# Altium schematic sheet WS2812 Xmas Lights.SchDoc
size A4
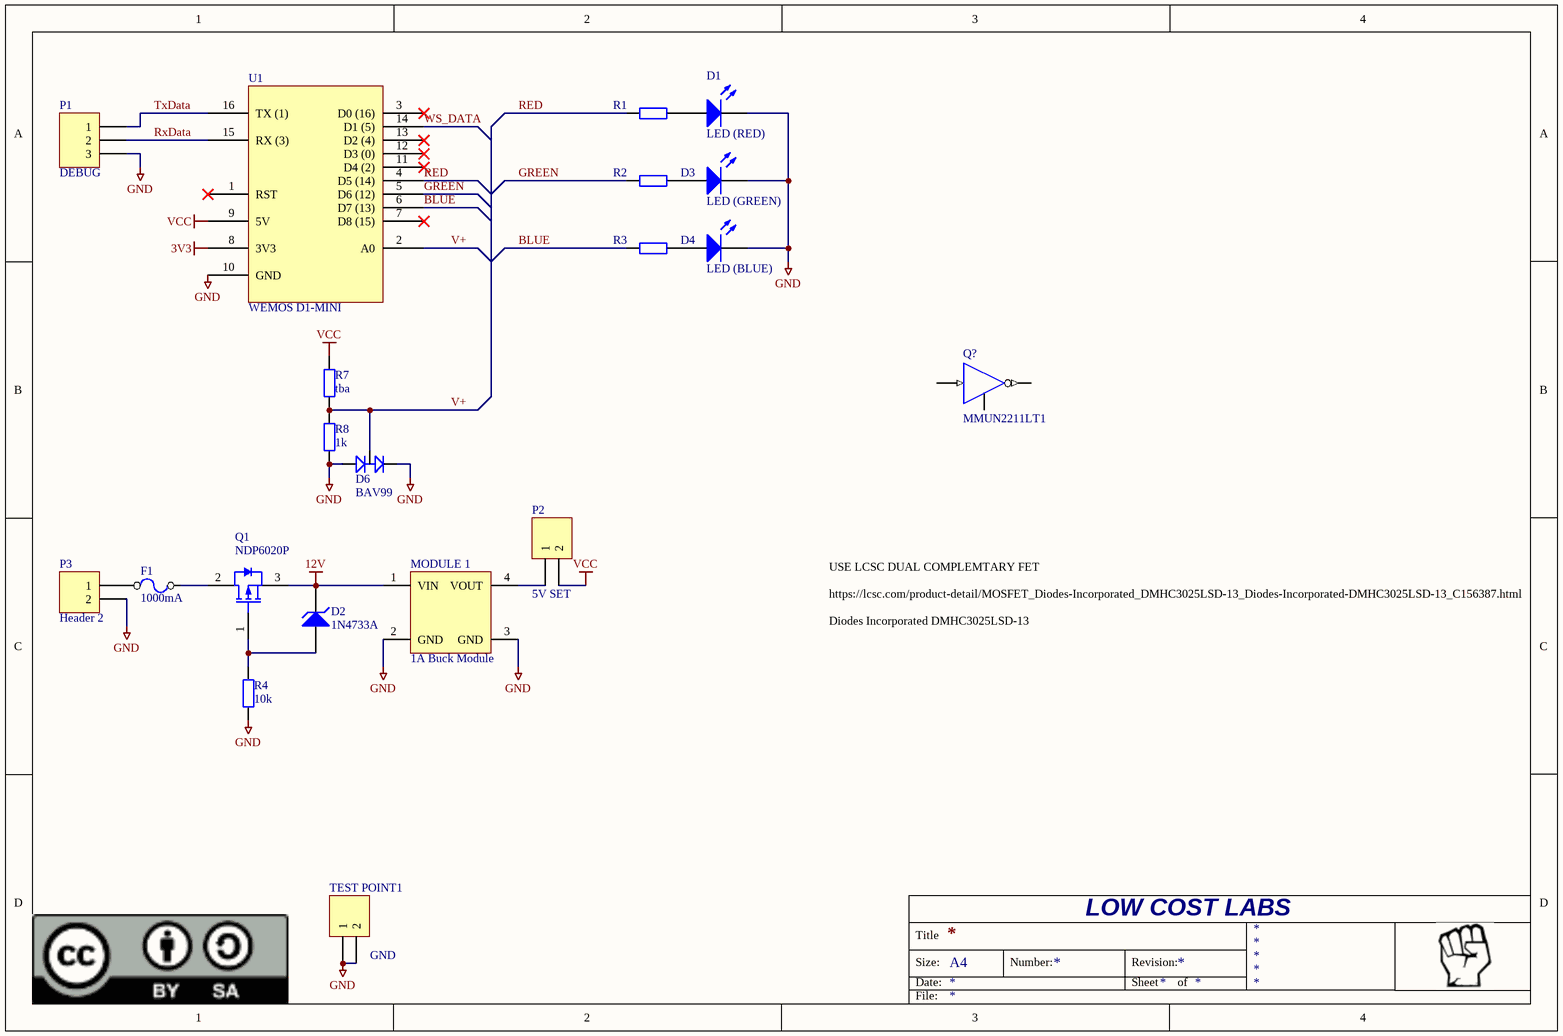
[diagram p0: WS2812 Xmas Lights.SchDoc]

## Parts
D1  LED (RED)  [LED(3D) 3MM VERTICAL (RED)]
D2  1N4733A  [DO-41]
D3  LED (GREEN)  [LED(3D) 3MM VERTICAL (GREEN)]
D4  LED (BLUE)  [LED(3D) 3MM VERTICAL (GREEN)]
D6  BAV99  [SOT23-3L]
F1  1000mA  [POLYSWITHC 1210]
MODULE_1  1A Buck Module  [3A BUCK]
P1  DEBUG  [Pin Header 1x3 TH Pitch 2.54mm]
P2  5V SET  [Pin Header 1x2 TH Pitch 2.54mm]
P3  Header 2  [2 FLYING WIRES]
Q1  NDP6020P  [TO-220AB - RIGHT ANGLE]
Q?  MMUN2211LT1  [SOT23-3L]
R1  (no value)  [RESISTOR 0805]
R2  (no value)  [RESISTOR 0805]
R3  (no value)  [RESISTOR 0805]
R4  10k  [RESISTOR 0805]
R7  tba  [RESISTOR 0805]
R8  1k  [RESISTOR 0805]
TEST_POINT1  GND  [Pin Header 1x2 TH Pitch 2.54mm]
U1  WEMOS D1-MINI  [WEMOS PRO MINI]

## Nets
3V3: U1.8(3V3)
12V: D2.1(K) MODULE_1.1(VIN) Q1.3(S)
GND: D1.2(K) D3.2(K) D4.2(K) D6.1(A1) D6.2(C2) MODULE_1.2(GND) MODULE_1.3(GND) P1.3 P3.2 R4.1 R8.1 TEST_POINT1.1 TEST_POINT1.2 U1.10(GND)
VCC: P2.2 R7.2 U1.9(5V)
BLUE: R3.2 U1.6(D7_(13))
GREEN: R2.1 U1.5(D6_(12))
RED: R1.1 U1.4(D5_(14))
RxData: P1.2 U1.15(RX_(3))
TxData: P1.1 U1.16(TX_(1))
V+: D6.3(C1/A2) R7.1 R8.2 U1.2(A0)
WS_DATA: U1.14(D1_(5))
NetD1_1: D1.1(A) R1.2
NetD2_2: D2.2(A) Q1.1(G) R4.2
NetD3_1: D3.1(A) R2.2
NetD4_1: D4.1(A) R3.1
NetF1_1: F1.1 P3.1
NetF1_2: F1.2 Q1.2(D)
NetMODULE_1_4: MODULE_1.4(VOUT) P2.1

Not connected (* = marked no-connect by the designer): Q? 1(B) 2(E) 3(C); U1 1(RST)* 3(D0_(16))* 7(D8_(15))* 11(D4_(2))* 12(D3_(0))* 13(D2_(4))*

## Notes on the sheet
- USE LCSC DUAL COMPLEMTARY FET
  https://lcsc.com/product-detail/MOSFET_Diodes-Incorporated_DMHC3025LSD-13_Diodes-Incorporated-DMHC3025LSD-13_C156387.html
  Diodes Incorporated DMHC3025LSD-13
- LOW COST LABS
- Title
- Size:
- Date:
- A4
- Number:
- Revision:
- Sheet
- of
- File:

## Library data of the parts
D1 D3 D4 = LED 3mm RED: 3mm RED LED; Manufacturer: Kingbright; Manufacturer Part No.: WP132XIT; Mouser Part no.: 604-WP132XIT; Farnell Part no.: 1003393; Web link: http://au.mouser.com/Search/Refine.aspx?Keyword=604-WP132XIT
D2 = DO-41: 1N4733A 5V ZENER DO-41; Output Current: 510 mA (max); Material: Glass; Power Rating: 1.00 W; Breakdown Voltage: 5.10 V; Lead-Free Status: Lead Free; REACH SVHC Compliance: No SVHC; Manufacturer Part Number: 1N4733A; Mounting Style: Through Hole; RoHS: Compliant; Voltage Rating (DC): 5.10 V; Lifecycle Status: Active; Octopart URL: http://octopart.com/1n4733a-multicomp-19660330; Number of Pins: 2; Packaging: Bulk; Power Dissipation: 1.00 W; OctopartID: 43988bb998d49c5f; Case/Package: DO-41
D6 = BAV99: DUAL DIODE, BAV99; Manufacturer: FAIRCHILD SEMICONDUCTOR; Mouser Part no.: 771-BAV99/T3; Farnell Part no.: 9843612; Manufacturer Part No.: BAV99; PackageReference: SOT-23; value: BAV99; Web link: http://au.mouser.com/ProductDetail/NXP-Semiconductors/BAV99-T3/?qs=sGAEpiMZZMtldOIVIVqa3WNg7zlWz8nBhXHsMX6ttIg%3d
F1 = PTC 12V POLYFUSE SMT 1210 1.10A: PTC 12V POLYFUSE SMT 1210 500mA (1210L110/12WR); Value: 1000mA
MODULE_1 = 3A Buck Module
P1 = Header 3: Header, 3 Pin; Manufacturer: FCI; Manufacturer Part No.: 68020-102; Mouser Part no.: 649-68020-102; Web link: http://au.mouser.com/ProductDetail/FCI/68020-102/?qs=sGAEpiMZZMs%252bGHln7q6pm44kDepmYTI87r6%2fnQtKGLI%3d
P2 P3 TEST_POINT1 = Header 2: Header, 2-Pin; Manufacturer: FCI; Manufacturer Part No.: 68020-102; Mouser Part no.: 649-68020-102; Web link: http://au.mouser.com/ProductDetail/FCI/68020-102/?qs=sGAEpiMZZMs%252bGHln7q6pm44kDepmYTI87r6%2fnQtKGLI%3d
Q1 = NDP6020P: Trans MOSFET P-CH 20V 24A TO-220AB NDP6020P; Drain to Source Voltage (Vds): -20.0 V; Continuous Drain Current (Ids): -24.0 A; Polarity: P-Channel; Power Dissipation: 50.0 W; Lead-Free Status: Lead Free; Drain to Source Resistance (on) (Rds): 75.0 m?; OctopartID: d65e1f9ca3c10999; Octopart URL: http://octopart.com/ndp6020p-fairchild+semiconductor-13127929; RoHS: Compliant; Current Rating: -24.0 A; REACH SVHC Compliance: No SVHC; Lifecycle Status: Active; Packaging: Tube; Manufacturer Part Number: NDP6020P; Voltage Rating (DC): -20.0 V; Number of Pins: 3; Case/Package: TO-220; Mounting Style: Through Hole
Q? = MMUN221LT1 NPN DIGITAL TRANSISTOR: Manufacturer: ON Semiconductor; Manufacturer Part No.: MMUN2211LT1G; Mouser Part no.: 863-MMUN2211LT1G; Farnell Part no.: 9556648RL; Web link: http://au.mouser.com/ProductDetail/ON-Semiconductor/MMUN2211LT1G/?qs=sGAEpiMZZMt32xmUYxteeYvHZcSNQKJZCO%252bIh%252bS%252bXZs%3d
R1-R4 R7 R8 = Res2: Resistor; Published: 8-Jun-2000; LatestRevisionDate: 17-Jul-2002; LatestRevisionNote: Re-released for DXP Platform.; PackageReference: AXIAL-0.4; Publisher: Altium Limited; PackageDescription: Axial Device, Thru-Hole; 2 Leads; 0.4 in Pin Spacing
  R4: Value: 10k
  R7: Value: tba
  R8: Value: 1k
U1 = WEMOS